# EAGLE design bunai3 (EAGLE 7.2.0)
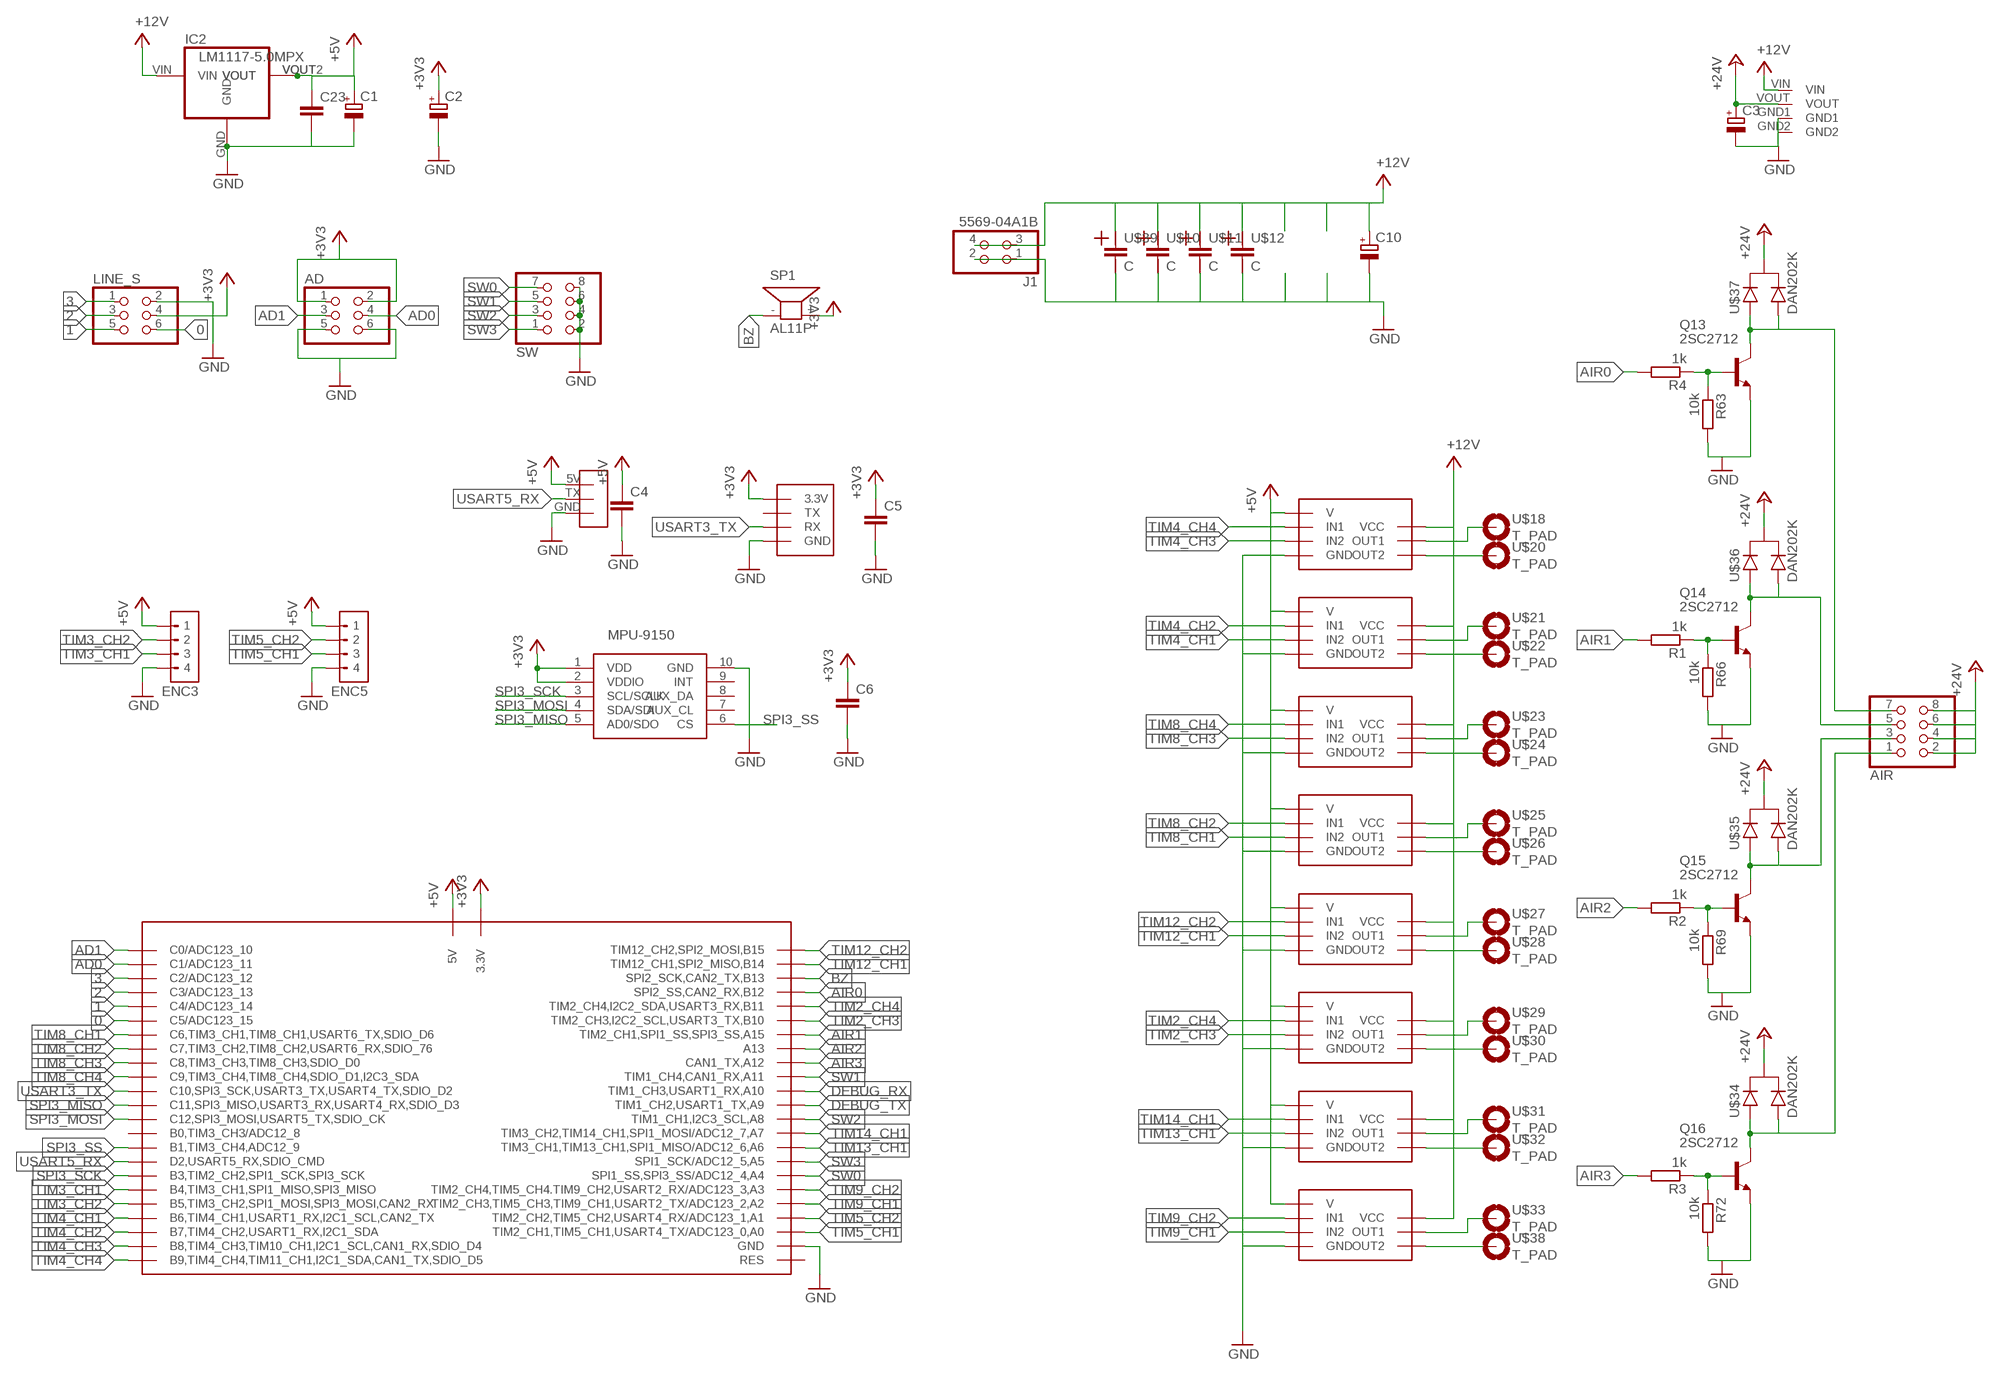
[diagram p0: schematic, sheet 1]

## Parts
AD  PINHD-2X3/90  [2X03/90]
AIR  PINHD-2X4/90  [2X04/90]
C1  CPOL-EUE2.5-6  [E2,5-6]
C2  CPOL-EUE2.5-6  [E2,5-6]
C3  CPOL-EUE2.5-6  [E2,5-6]
C4  C-EU025-024X044  [C025-024X044]
C5  C-EU025-024X044  [C025-024X044]
C6  C-EU025-024X044  [C025-024X044]
C10  CPOL-EUE2.5-6  [E2,5-6]
C23  C-EUC0603K  [C0603K]
ENC3  CN4-JST-XH-TOP  [JST-B4B-XH-A]
ENC5  CN4-JST-XH-TOP  [JST-B4B-XH-A]
IC2  LM1117-5.0MPX  LM1117-5.0IMP  [SOT223]
J1  5569-04A1B  [5569-04A1_2]
LINE_S  PINHD-2X3/90  [2X03/90]
MPU-9250  MPU-9250  [MPU-9250]
Q13  2SC2712  [SC-59(TYPE1)]
Q14  2SC2712  [SC-59(TYPE1)]
Q15  2SC2712  [SC-59(TYPE1)]
Q16  2SC2712  [SC-59(TYPE1)]
R1  1k  R-EU_0207/7  [0207/7]
R2  1k  R-EU_0207/7  [0207/7]
R3  1k  R-EU_0207/7  [0207/7]
R4  1k  R-EU_0207/7  [0207/7]
R63  10k  R-EU_R0603  [R0603]
R66  10k  R-EU_R0603  [R0603]
R69  10k  R-EU_R0603  [R0603]
R72  10k  R-EU_R0603  [R0603]
SP1  AL11P  [AL11P]
SW  PINHD-2X4/90  [2X04/90]
U$1  F4_T  [F4_T]
U$2  BTM7752_T  [BTM7752_T]
U$3  BTM7752_T  [BTM7752_T]
U$4  BTM7752_T  [BTM7752_T]
U$5  BTM7752_T  [BTM7752_T]
U$6  BTM7752_T  [BTM7752_T]
U$7  BTM7752_T  [BTM7752_T]
U$8  BTM7752_T  [BTM7752_T]
U$9  BTM7752_T  [BTM7752_T]
U$10  C  [C]
U$11  C  [C]
U$12  C  [C]
U$16  LT3580  [LT3580]
U$17  SBDBT_5V  [SBDBT_5V]
U$18  T_PAD  [T_PAD]
U$19  XBEE_T  [XBEE_T]
U$20  T_PAD  [T_PAD]
U$21  T_PAD  [T_PAD]
U$22  T_PAD  [T_PAD]
U$23  T_PAD  [T_PAD]
U$24  T_PAD  [T_PAD]
U$25  T_PAD  [T_PAD]
U$26  T_PAD  [T_PAD]
U$27  T_PAD  [T_PAD]
U$28  T_PAD  [T_PAD]
U$29  T_PAD  [T_PAD]
U$30  T_PAD  [T_PAD]
U$31  T_PAD  [T_PAD]
U$32  T_PAD  [T_PAD]
U$33  T_PAD  [T_PAD]
U$34  DAN202K  [SC-59]
U$35  DAN202K  [SC-59]
U$36  DAN202K  [SC-59]
U$37  DAN202K  [SC-59]
U$38  T_PAD  [T_PAD]
U$39  C  [C]

## Nets
0: LINE_S.6 U$1.C5(C5/ADC123_15)
1: LINE_S.5 U$1.C4(C4/ADC123_14)
2: LINE_S.3 U$1.C3(C3/ADC123_13)
3: LINE_S.1 U$1.C2(C2/ADC123_12)
+3V3: AD.1 AD.2 C2.+ C5.1 C6.1 LINE_S.4 MPU-9250.1(VDD) MPU-9250.2(VDDIO) SP1.+ U$1.3.3V U$1.3.3V1(3.3V) U$19.3.3V
+5V [VCC]: C1.+ C4.1 C23.1 ENC3.1 ENC5.1 IC2.VOUT IC2.VOUT2(VOUT) U$1.5V U$1.5V1(5V) U$2.V U$3.V U$4.V U$5.V U$6.V U$7.V U$8.V U$9.V U$17.5V
+24V: AIR.2 AIR.4 AIR.6 AIR.8 C3.+ U$16.VOUT U$34.K U$35.K U$36.K U$37.K
AD0: AD.4 U$1.C1(C1/ADC123_11)
AD1: AD.3 U$1.C0(C0/ADC123_10)
AIR0: R4.2 U$1.B12(SPI2_SS,CAN2_RX,B12)
AIR1: R1.2 U$1.A15(TIM2_CH1,SPI1_SS,SPI3_SS,A15)
AIR2: R2.2 U$1.A13
AIR3: R3.2 U$1.A12(CAN1_TX,A12)
BZ: SP1.- U$1.B13(SPI2_SCK,CAN2_TX,B13)
DEBUG_RX: U$1.A10(TIM1_CH3,USART1_RX,A10)
DEBUG_TX: U$1.A9(TIM1_CH2,USART1_TX,A9)
GND: AD.5 AD.6 C1.- C2.- C3.- C4.2 C5.2 C6.2 C10.- C23.2 ENC3.4 ENC5.4 IC2.GND J1.1 J1.2 LINE_S.2 MPU-9250.10(GND) Q13.E Q14.E Q15.E Q16.E R63.2 R66.2 R69.2 R72.2 SW.2 SW.4 SW.6 SW.8 U$1.GND1(GND) U$1.GND2(GND) U$1.GND3(GND) U$2.GND1(GND) U$2.GND2(GND) U$2.GND3(GND) U$3.GND1(GND) U$3.GND2(GND) U$3.GND3(GND) U$4.GND1(GND) U$4.GND2(GND) U$4.GND3(GND) U$5.GND1(GND) U$5.GND2(GND) U$5.GND3(GND) U$6.GND1(GND) U$6.GND2(GND) U$6.GND3(GND) U$7.GND1(GND) U$7.GND2(GND) U$7.GND3(GND) U$8.GND1(GND) U$8.GND2(GND) U$8.GND3(GND) U$9.GND1(GND) U$9.GND2(GND) U$9.GND3(GND) U$16.GND1 U$16.GND2 U$17.GND U$19.GND
N$5: U$9.OUT11(OUT1) U$9.OUT12(OUT1) U$9.OUT13(OUT1) U$9.OUT14(OUT1) U$18.P$1(MOUNT)
N$6: U$9.OUT21(OUT2) U$9.OUT22(OUT2) U$9.OUT23(OUT2) U$9.OUT24(OUT2) U$20.P$1(MOUNT)
N$7: U$8.OUT11(OUT1) U$8.OUT12(OUT1) U$8.OUT13(OUT1) U$8.OUT14(OUT1) U$21.P$1(MOUNT)
N$8: U$8.OUT21(OUT2) U$8.OUT22(OUT2) U$8.OUT23(OUT2) U$8.OUT24(OUT2) U$22.P$1(MOUNT)
N$9: U$7.OUT11(OUT1) U$7.OUT12(OUT1) U$7.OUT13(OUT1) U$7.OUT14(OUT1) U$23.P$1(MOUNT)
N$10: U$7.OUT21(OUT2) U$7.OUT22(OUT2) U$7.OUT23(OUT2) U$7.OUT24(OUT2) U$24.P$1(MOUNT)
N$11: U$6.OUT11(OUT1) U$6.OUT12(OUT1) U$6.OUT13(OUT1) U$6.OUT14(OUT1) U$25.P$1(MOUNT)
N$12: U$6.OUT21(OUT2) U$6.OUT22(OUT2) U$6.OUT23(OUT2) U$6.OUT24(OUT2) U$26.P$1(MOUNT)
N$13: U$5.OUT11(OUT1) U$5.OUT12(OUT1) U$5.OUT13(OUT1) U$5.OUT14(OUT1) U$27.P$1(MOUNT)
N$14: U$5.OUT21(OUT2) U$5.OUT22(OUT2) U$5.OUT23(OUT2) U$5.OUT24(OUT2) U$28.P$1(MOUNT)
N$15: U$4.OUT11(OUT1) U$4.OUT12(OUT1) U$4.OUT13(OUT1) U$4.OUT14(OUT1) U$29.P$1(MOUNT)
N$16: U$4.OUT21(OUT2) U$4.OUT22(OUT2) U$4.OUT23(OUT2) U$4.OUT24(OUT2) U$30.P$1(MOUNT)
N$17: U$3.OUT11(OUT1) U$3.OUT12(OUT1) U$3.OUT13(OUT1) U$3.OUT14(OUT1) U$31.P$1(MOUNT)
N$18: U$3.OUT21(OUT2) U$3.OUT22(OUT2) U$3.OUT23(OUT2) U$3.OUT24(OUT2) U$32.P$1(MOUNT)
N$19: U$2.OUT11(OUT1) U$2.OUT12(OUT1) U$2.OUT13(OUT1) U$2.OUT14(OUT1) U$33.P$1(MOUNT)
N$20: U$2.OUT21(OUT2) U$2.OUT22(OUT2) U$2.OUT23(OUT2) U$2.OUT24(OUT2) U$38.P$1(MOUNT)
N$95: Q13.B R4.1 R63.1
N$96: AIR.7 Q13.C U$37.A@1(A1) U$37.A@2(A2)
N$101: Q14.B R1.1 R66.1
N$102: AIR.5 Q14.C U$36.A@1(A1) U$36.A@2(A2)
N$105: Q15.B R2.1 R69.1
N$106: AIR.3 Q15.C U$35.A@1(A1) U$35.A@2(A2)
N$108: AIR.1 Q16.C U$34.A@1(A1) U$34.A@2(A2)
N$109: Q16.B R3.1 R72.1
SPI3_MISO: MPU-9250.5(AD0/SDO) U$1.C11(C11,SPI3_MISO,USART3_RX,USART4_RX,SDIO_D3)
SPI3_MOSI: MPU-9250.4(SDA/SDI) U$1.C12(C12,SPI3_MOSI,USART5_TX,SDIO_CK)
SPI3_SCK: MPU-9250.3(SCL/SCLK) U$1.B3(B3,TIM2_CH2,SPI1_SCK,SPI3_SCK)
SPI3_SS: MPU-9250.6(CS) U$1.B1(B1,TIM3_CH4,ADC12_9)
SW0: SW.7 U$1.A4(SPI1_SS,SPI3_SS/ADC12_4,A4)
SW1: SW.5 U$1.A11(TIM1_CH4,CAN1_RX,A11)
SW2: SW.3 U$1.A8(TIM1_CH1,I2C3_SCL,A8)
SW3: SW.1 U$1.A5(SPI1_SCK/ADC12_5,A5)
TIM2_CH3: U$1.B10(TIM2_CH3,I2C2_SCL,USART3_TX,B10) U$4.IN2
TIM2_CH4: U$1.B11(TIM2_CH4,I2C2_SDA,USART3_RX,B11) U$4.IN1
TIM3_CH1: ENC3.3 U$1.B4(B4,TIM3_CH1,SPI1_MISO,SPI3_MISO)
TIM3_CH2: ENC3.2 U$1.B5(B5,TIM3_CH2,SPI1_MOSI,SPI3_MOSI,CAN2_RX)
TIM4_CH1: U$1.B6(B6,TIM4_CH1,USART1_RX,I2C1_SCL,CAN2_TX) U$8.IN2
TIM4_CH2: U$1.B7(B7,TIM4_CH2,USART1_RX,I2C1_SDA) U$8.IN1
TIM4_CH3: U$1.B8(B8,TIM4_CH3,TIM10_CH1,I2C1_SCL,CAN1_RX,SDIO_D4) U$9.IN2
TIM4_CH4: U$1.B9(B9,TIM4_CH4,TIM11_CH1,I2C1_SDA,CAN1_TX,SDIO_D5) U$9.IN1
TIM5_CH1: ENC5.3 U$1.A0(TIM2_CH1,TIM5_CH1,USART4_TX/ADC123_0,A0)
TIM5_CH2: ENC5.2 U$1.A1(TIM2_CH2,TIM5_CH2,USART4_RX/ADC123_1,A1)
TIM8_CH1: U$1.C6(C6,TIM3_CH1,TIM8_CH1,USART6_TX,SDIO_D6) U$6.IN2
TIM8_CH2: U$1.C7(C7,TIM3_CH2,TIM8_CH2,USART6_RX,SDIO_76) U$6.IN1
TIM8_CH3: U$1.C8(C8,TIM3_CH3,TIM8_CH3,SDIO_D0) U$7.IN2
TIM8_CH4: U$1.C9(C9,TIM3_CH4,TIM8_CH4,SDIO_D1,I2C3_SDA) U$7.IN1
TIM9_CH1: U$1.A2(TIM2_CH3,TIM5_CH3,TIM9_CH1,USART2_TX/ADC123_2,A2) U$2.IN2
TIM9_CH2: U$1.A3(TIM2_CH4,TIM5_CH4.TIM9_CH2,USART2_RX/ADC123_3,A3) U$2.IN1
TIM12_CH1: U$1.B14(TIM12_CH1,SPI2_MISO,B14) U$5.IN2
TIM12_CH2: U$1.B15(TIM12_CH2,SPI2_MOSI,B15) U$5.IN1
TIM13_CH1: U$1.A6(TIM3_CH1,TIM13_CH1,SPI1_MISO/ADC12_6,A6) U$3.IN2
TIM14_CH1: U$1.A7(TIM3_CH2,TIM14_CH1,SPI1_MOSI/ADC12_7,A7) U$3.IN1
USART3_TX: U$1.C10(C10,SPI3_SCK,USART3_TX,USART4_TX,SDIO_D2) U$19.RX
USART5_RX: U$1.D2(D2,USART5_RX,SDIO_CMD) U$17.TX(TX_5V)
V+: C10.+ IC2.VIN J1.3 J1.4 U$2.VCC1(VCC) U$2.VCC2(VCC) U$2.VCC3(VCC) U$2.VCC4(VCC) U$3.VCC1(VCC) U$3.VCC2(VCC) U$3.VCC3(VCC) U$3.VCC4(VCC) U$4.VCC1(VCC) U$4.VCC2(VCC) U$4.VCC3(VCC) U$4.VCC4(VCC) U$5.VCC1(VCC) U$5.VCC2(VCC) U$5.VCC3(VCC) U$5.VCC4(VCC) U$6.VCC1(VCC) U$6.VCC2(VCC) U$6.VCC3(VCC) U$6.VCC4(VCC) U$7.VCC1(VCC) U$7.VCC2(VCC) U$7.VCC3(VCC) U$7.VCC4(VCC) U$8.VCC1(VCC) U$8.VCC2(VCC) U$8.VCC3(VCC) U$8.VCC4(VCC) U$9.VCC1(VCC) U$9.VCC2(VCC) U$9.VCC3(VCC) U$9.VCC4(VCC) U$16.VIN ; supply symbol labelled +12V
Unconnected: MPU-9250.7(AUX_CL) MPU-9250.8(AUX_DA) MPU-9250.9(INT) U$1.B0(B0,TIM3_CH3/ADC12_8) U$1.RES U$19.TX

## Library data of the parts
AD LINE_S = pinhead:PINHD-2X3: PIN HEADER
AIR SW = pinhead:PINHD-2X4: PIN HEADER
C1-C3 C10 = rcl:CPOL-EU: POLARIZED CAPACITOR, European symbol
C4-C6 = rcl:C-EU: CAPACITOR, European symbol
C23 = resistor:C-EU: CAPACITOR, European symbol
ENC3 ENC5 = con-jst_xh:CN4: Connector 4 circuits
IC2 = Regulator:LM1117: 800mA and 1A Low Dropout (LDO) Positive Regulator 1.8V, 2.5V, 2.85V, 3.3V, 5V, and Adj
J1 = Molex:5569-04A1
MPU-9250 = MPU-9250:MPU-9250
Q13-Q16 = Transistor:2SC2712
R1-R4 R63 R66 R69 R72 = rcl:R-EU_: RESISTOR, European symbol
SP1 = buzzer:AL11P: SPEAKER Source: Buerklin; OC_FARNELL: unknown; OC_NEWARK: unknown
U$1 = f4_t:F4_T
U$2-U$9 = BTM7752_t:BTM7752_T
U$10-U$12 U$39 = T_C:C
U$16 = lt3580:LT3580
U$17 = SBDBT_5V:SBDBT_5V
U$18 U$20-U$33 U$38 = T_pad:T_PAD
U$19 = Xbee_t:XBEE_T
U$34-U$37 = DAN202K:DAN202K

## Board
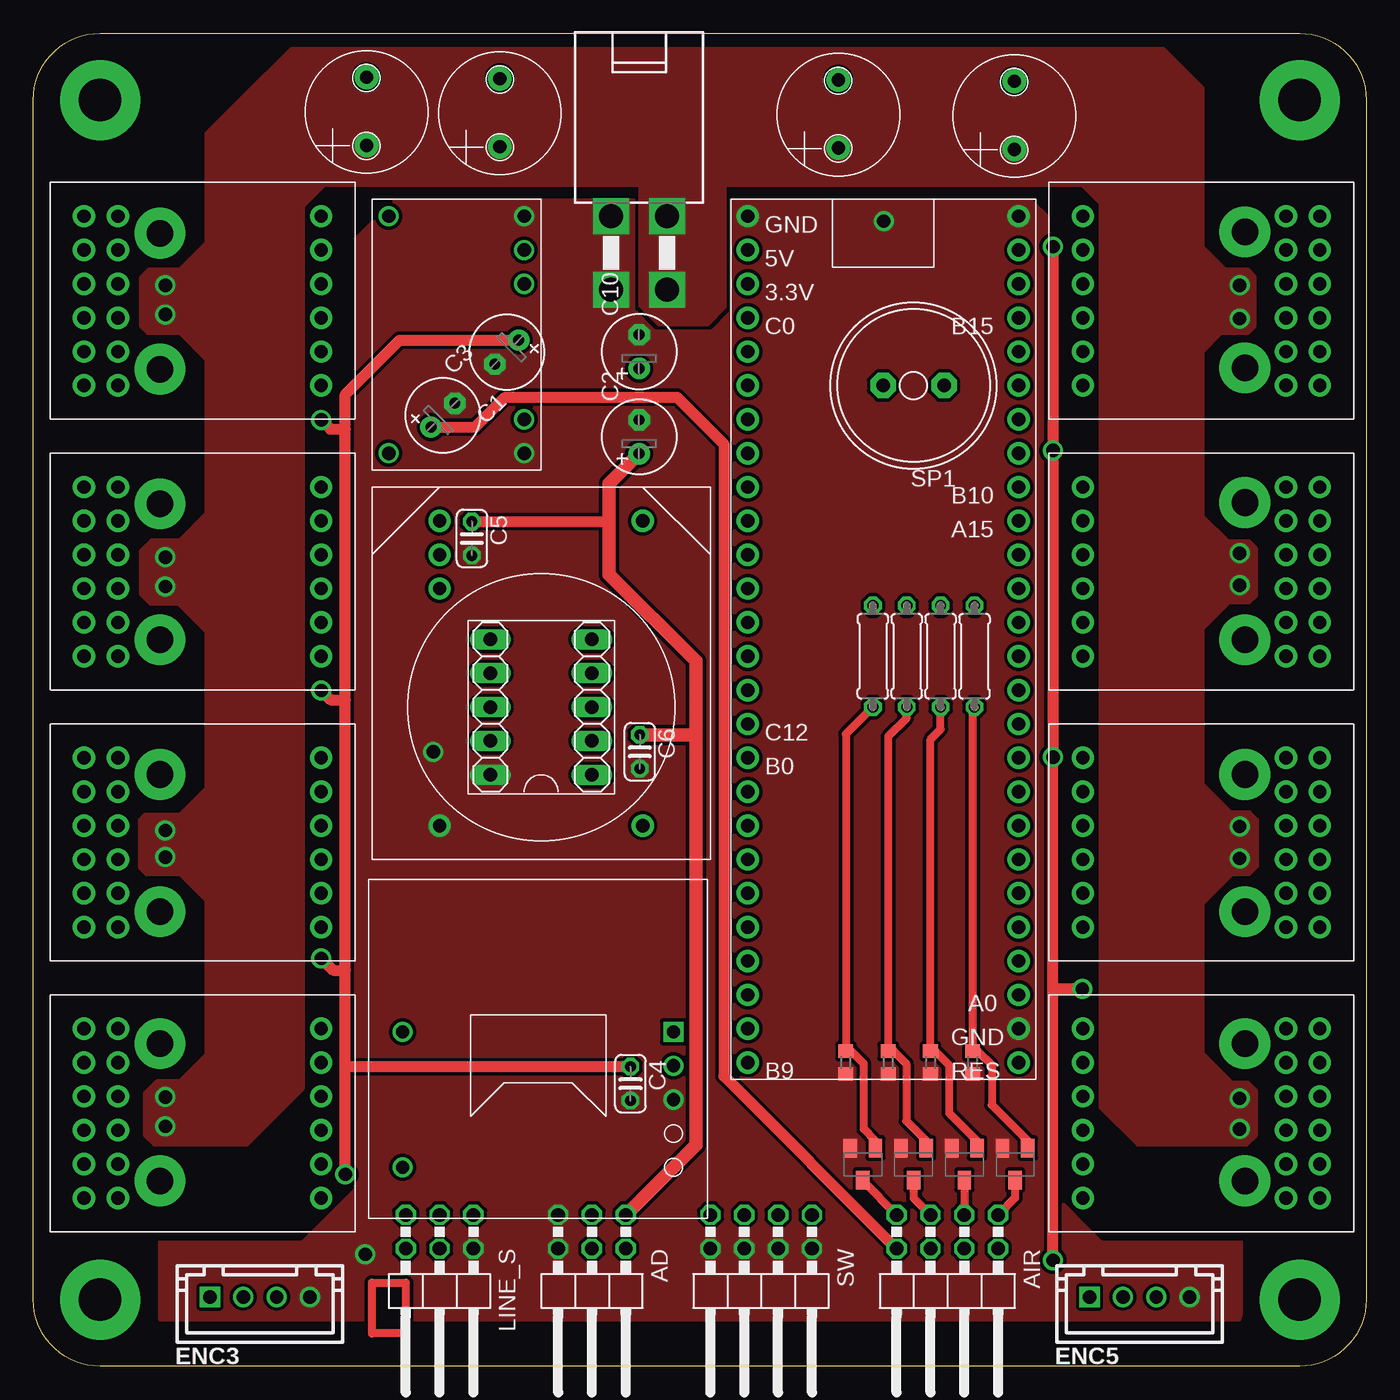
[diagram p1: board, top side]
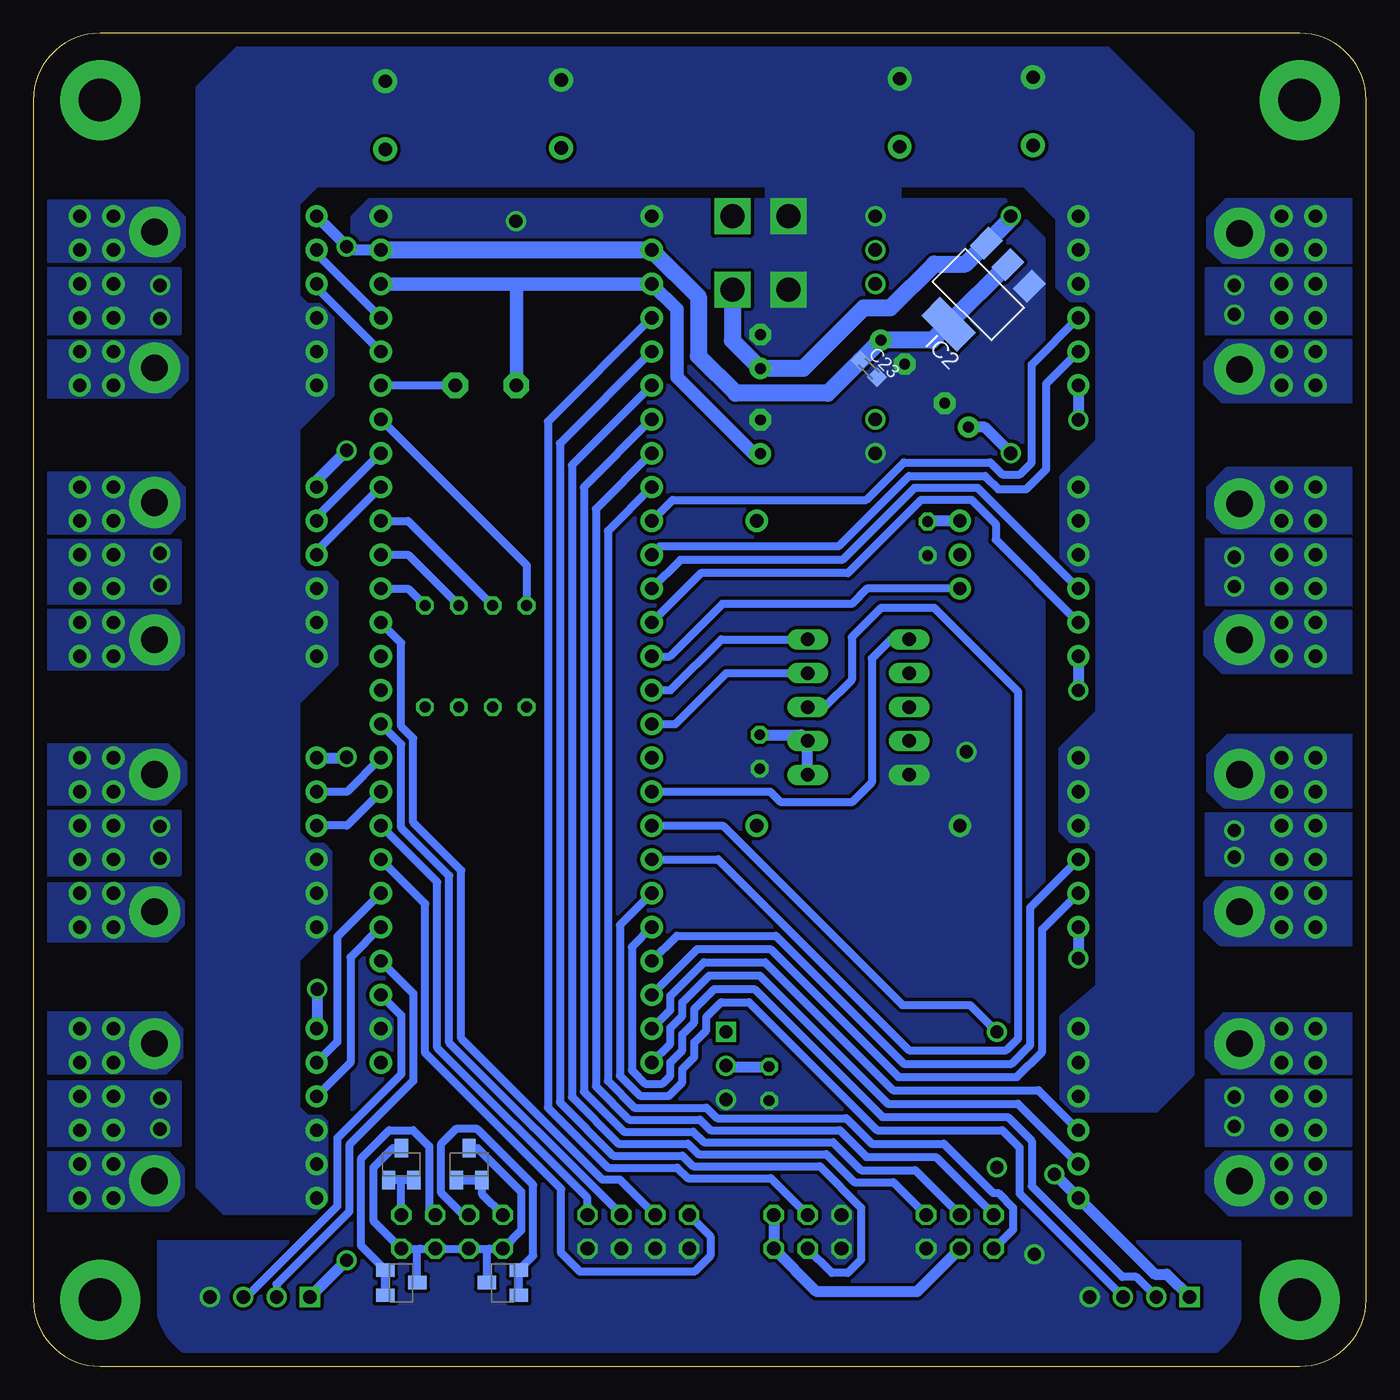
[diagram p2: board, bottom side, seen from below]

Size 100 x 100 mm. Coordinates in mm from the lower left corner, seen from the top.
Outline: 0,95 arc-90 5,100 95,100 arc-90 100,95 100,5 arc-90 95,0 5,0 arc-90 0,5 0,95
Copper layers (1*16): Top 0.035mm / dielectric 1.5mm / Bottom 0.035mm
Design rules "default *": minimum track width 10mil, minimum drill 24mil, track to track 10mil, track to pad 10mil, pad to pad 10mil, via to via 10mil, smd to smd 10mil, copper to edge 40mil, drill to drill 8mil, minimum pad ring 10mil, minimum via ring 8mil, stop-mask expansion 4mil, vias tented up to drill 0mil, thermal gap 10mil
tRestrict: 12 lines
bRestrict: 12 lines

### Footprints (pad centres in the part's own frame; a part is rotated, then mirrored left to right if it is on the bottom)
2X03/90 = drill 1.016 octagon: 1 -2.54,-6.35; 2 -2.54,-3.81; 3 0,-6.35; 4 0,-3.81; 5 2.54,-6.35; 6 2.54,-3.81
2X04/90 = drill 1.016 octagon: 1 -3.81,-6.35; 2 -3.81,-3.81; 3 -1.27,-6.35; 4 -1.27,-3.81; 5 1.27,-6.35; 6 1.27,-3.81; 7 3.81,-6.35; 8 3.81,-3.81
E2,5-6 = drill 0.813 pad 1.6: + -1.27,0 | drill 0.813 pad 1.6 octagon: - 1.27,0
C025-024X044 = drill 0.813 octagon: 1 -1.27,0; 2 1.27,0
C0603K = smd 1.05 x 1.08: 1 -0.875,0; 2 0.875,0
JST-B4B-XH-A = drill 1 square: 1 -3.75,0 | drill 1: 2 -1.25,0; 3 1.25,0; 4 3.75,0
SOT223 = smd 1.499 x 2.007: GND -2.261,-3.15; VIN 2.311,-3.15; VOUT 0.025,-3.15 | smd 3.81 x 2.007: VOUT2 0,3.15
5569-04A1_2 = drill 1.8 square: 1 2.1,0; 2 2.1,5.5; 3 -2.1,0; 4 -2.1,5.5
MPU-9250 = drill 1.016 long: 1 -3.81,5.08; 2 -3.81,2.54; 3 -3.81,0; 4 -3.81,-2.54; 5 -3.81,-5.08; 6 3.81,-5.08; 7 3.81,-2.54; 8 3.81,0; 9 3.81,2.54; 10 3.81,5.08
SC-59(TYPE1) = smd 1 x 1.4: B -0.95,-1.2; C 0,1.2; E 0.95,-1.2
0207/7 = drill 0.813 octagon: 1 -3.81,0; 2 3.81,0
R0603 = smd 1 x 1.1: 1 -0.85,0; 2 0.85,0
AL11P = drill 1.016 pad 1.905 octagon: + 2.286,0; - -2.286,0
F4_T = drill 1 pad 1.676: 3.3V -10.16,36.83; 3.3V1 10.16,36.83; 5V -10.16,39.37; 5V1 10.16,39.37; A0 10.16,-16.51; A1 10.16,-13.97; A2 10.16,-11.43; A3 10.16,-8.89; A4 10.16,-6.35; A5 10.16,-3.81; A6 10.16,-1.27; A7 10.16,1.27; A8 10.16,3.81; A9 10.16,6.35; A10 10.16,8.89; A11 10.16,11.43; A12 10.16,13.97; A13 10.16,16.51; A15 10.16,19.05; B0 -10.16,1.27; B1 -10.16,-1.27; B3 -10.16,-6.35; B4 -10.16,-8.89; B5 -10.16,-11.43; B6 -10.16,-13.97; B7 -10.16,-16.51; B8 -10.16,-19.05; B9 -10.16,-21.59; B10 10.16,21.59; B11 10.16,24.13; B12 10.16,26.67; B13 10.16,29.21; B14 10.16,31.75; B15 10.16,34.29; C0 -10.16,34.29; C1 -10.16,31.75; C2 -10.16,29.21; C3 -10.16,26.67; C4 -10.16,24.13; C5 -10.16,21.59; C6 -10.16,19.05; C7 -10.16,16.51; C8 -10.16,13.97; C9 -10.16,11.43; C10 -10.16,8.89; C11 -10.16,6.35; C12 -10.16,3.81; D2 -10.16,-3.81; GND1 -10.16,41.91; GND2 10.16,41.91; GND3 10.16,-19.05; RES 10.16,-21.59
BTM7752_T = drill 1 pad 1.676: GND1 -7.62,-1.27; GND2 -7.62,-3.81; GND3 -7.62,-6.35; IN1 -7.62,3.81; IN2 -7.62,1.27; OUT11 7.62,-3.81; OUT12 10.16,-3.81; OUT13 7.62,-6.35; OUT14 10.16,-6.35; OUT21 7.62,6.35; OUT22 10.16,6.35; OUT23 7.62,3.81; OUT24 10.16,3.81; V -7.62,6.35; VCC1 7.62,1.27; VCC2 10.16,1.27; VCC3 7.62,-1.27; VCC4 10.16,-1.27
LT3580 = drill 1: GND1 1.27,11.43; GND2 19.05,11.43; P$2 3.81,11.43; P$4 6.35,11.43; P$5 16.51,11.43; VIN 1.27,1.27; VOUT 19.05,1.27
SBDBT_5V = drill 1 square: 1 10.16,1.27 | drill 1: 5V 10.16,-1.27; GND 10.16,-3.81; RX -10.16,-8.89; TX -10.16,1.27
T_PAD = drill 2 pad 3.81: P$1 0,0
XBEE_T = drill 1 pad 1.676: 3.3V -7.62,22.86; GND -7.62,0; P$2 7.62,0; P$4 7.62,22.86; RX -7.62,17.78; TX -7.62,20.32
SC-59 = smd 1 x 1.4: A@1 -0.95,-1.2; A@2 0.95,-1.2; K 0,1.2

### Placement (x,y rotation side)
AD  41.91,5 180 top
AIR  68.58,5 180 top
C1  35.52,76.08 225 top
C2  45.45,69.73 90 top
C3  30.73,71.35 45 top
C4  44.8,21.2 270 top
C5  32.9,62.1 270 top
C6  45.5,46.1 270 top
C10  45.45,76.12 90 top
C23  37.32,74.83 315 bottom
ENC3  17,5.19 0 top
ENC5  83,5.19 0 top
IC2  29.1,80.4 135 bottom
J1  45.45,86.28 180 top
LINE_S  30.48,5 180 top
MPU-9250  38.1,49.45 180 top
Q13  62.23,15.16 180 top
Q14  66.04,15.16 180 top
Q15  69.85,15.16 180 top
Q16  73.66,15.16 180 top
R1  65.53,53.26 90 top
R2  68.07,53.26 90 top
R3  70.61,53.26 90 top
R4  62.99,53.26 90 top
R63  60.96,22.78 270 top
R66  64.14,22.78 270 top
R69  67.31,22.78 270 top
R72  70.48,22.78 270 top
SP1  66.04,73.58 180 top
SW  54.61,5 180 top
U$1  63.77,44.37 0 top
U$2  86.36,18.97 0 top
U$3  86.36,39.29 0 top
U$4  86.36,59.61 0 top
U$5  86.36,79.93 0 top
U$6  13.97,79.93 180 top
U$7  13.97,59.61 180 top
U$8  13.97,39.29 180 top
U$9  13.97,18.97 180 top
U$10  25,94.1 90 top
U$11  73.6,93.8 90 top
U$12  60.4,93.9 90 top
U$16  25.4,87.55 270 top
U$17  37.87,23.81 0 top
U$18  9.5,24.2 0 top
U$19  38.1,40.56 0 top
U$20  9.5,13.9 0 top
U$21  9.5,44.4 0 top
U$22  9.5,34.1 0 top
U$23  9.5,64.7 0 top
U$24  9.5,54.5 0 top
U$25  9.5,85 0 top
U$26  9.5,74.8 0 top
U$27  90.9,74.9 0 top
U$28  90.9,85.1 0 top
U$29  90.9,54.5 0 top
U$30  90.9,64.8 0 top
U$31  90.9,34.1 0 top
U$32  90.9,44.4 0 top
U$33  90.9,13.9 0 top
U$34  72.39,15.16 0 bottom
U$35  72.39,6.27 270 bottom
U$36  64.77,6.27 90 bottom
U$37  67.31,15.16 0 bottom
U$38  90.9,24.2 0 top
U$39  35,94 90 top

### Tracks (layer width: path | path; a pad name or v marks a point on that pad's centre or on a via)
0
  Bottom 0.61: LINE_S.6 26.5,10.25 26.5,11.9 27.6,13 28,13 31.7,16.7 37.1,16.7 39,18.6 48.7,18.6 49.5,19.4 54.9,19.4 56.9,21.4 56.9,62.67 U$1.C5
1
  Bottom 0.61: LINE_S.5 32.29,15.7 37.5,15.7 39.5,17.7 49.2,17.7 50,18.5 55.3,18.5 57.8,21 57.8,64.31 U$1.C4
2
  Bottom 0.61: LINE_S.3 33.83,14.7 37.9,14.7 40,16.8 49.7,16.8 50.5,17.6 55.7,17.6 58.7,20.6 58.7,65.95 U$1.C3
3
  Bottom 0.61: LINE_S.1 35.47,13.8 38.4,13.8 40.5,15.9 50.1,15.9 50.9,16.7 56.1,16.7 59.6,20.2 59.6,67.59 U$1.C2
+3V3
  Top 0.813: C5.1 43.17,63.37 43.2,63.4
  Top 1.016: 49.7,47.3 49.7,52.9 43.2,59.4 43.2,63.4 43.2,66.21 C2.+ | 49.7,47.3 49.7,16.6 AD.1 | C6.1 49.63,47.37 49.7,47.3
  Bottom 0.813: LINE_S.4 33.69,5.6 41.24,5.6 AD.2 AD.1 | U$19.3.3V 32.85,63.42 C5.1 | MPU-9250.1 MPU-9250.2 42.37,47.37 C6.1
  Bottom 1.016: U$1.3.3V1 63.8,81.2 | 63.8,81.2 U$1.3.3V 51.7,79.29 51.7,74.2 45.96,68.46 C2.+ | SP1.+ 63.75,81.15 63.8,81.2
+5V  (via drill 1)
  Top 0.813: v76.5,84 v76.5,68.7 v76.5,45.7 76.5,28.3 | v76.5,7.94 76.5,28.3 | v78.7,28.3 76.5,28.3 | v23.4,14.4 23.4,22.6 | 23.4,22.6 23.4,29.7 | 23.4,29.7 23.4,50 | 23.4,50 23.4,70.3 | 23.4,70.3 23.4,72.9 27.48,76.98 C1.+ | v21.6,71 22.3,70.3 23.4,70.3 | v21.6,50.7 22.3,50 23.4,50 | v21.6,30.6 22.5,29.7 23.4,29.7 | C4.1 23.53,22.47 23.4,22.6
  Bottom 0.813: U$5.V 76.5,84.04 v76.5,84 76.24,83.74 U$1.5V1 | v78.7,28.3 78.7,25.36 U$2.V | U$3.V 76.56,45.64 v76.5,45.7 | U$4.V 78.74,66.46 v76.5,68.7 | ENC3.1 14.96,6.9 15.87,6.9 U$9.V 23.37,14.4 v23.4,14.4 | v76.5,7.94 ENC5.1 | U$6.V v21.59,71.01 v21.6,71 | U$7.V v21.6,50.7 | U$8.V v21.59,30.61 v21.6,30.6 | U$17.5V 47.96,22.47 C4.1
  Bottom 1.27: U$1.5V1 U$1.5V 50.1,80.23 50.1,75.8 47.3,73 40.4,73 C23.1 36.42,76.97 C1.+ 32.56,76.98 31.33,78.21 | IC2.VOUT 31.33,78.21 | 31.33,78.21 IC2.VOUT2
+24V
  Top 0.813: C3.+ 33.15,70.45 35.4,72.7 48.3,72.7 51.8,69.2 51.8,21.78 AIR.8
  Bottom 0.61: U$36.K 65.97,8.64 65.8,8.81 | 71,8.81 AIR.2 74.5,10.92 74.5,14.9 73.04,16.36 U$34.K | 71,8.81 AIR.4 AIR.6 65.8,8.81 | 65.8,8.81 AIR.8 63.4,10.18 63.4,13.1 66.66,16.36 U$37.K | U$35.K 71.19,8.62 71,8.81
  Bottom 0.813: U$16.VOUT 28.62,70.45 C3.+
AD0
  Bottom 0.61: AD.4 40.1,7 38.9,7 37.9,8 37.9,11.9 41,15 50.5,15 51.3,15.8 56.5,15.8 60.5,19.8 60.5,69.23 U$1.C1
AD1
  Bottom 0.61: AD.3 44.66,14.1 50.9,14.1 51.7,14.9 56.9,14.9 61.4,19.4 61.4,70.87 U$1.C0
AIR0
  Bottom 0.61: U$1.B12 62.99,60.1 R4.2
AIR1
  Bottom 0.61: U$1.A15 71.88,63.42 R1.2
AIR2
  Bottom 0.61: U$1.A13 71.88,60.88 R2.2
AIR3
  Bottom 0.61: U$1.A12 71.88,58.34 R3.2
BZ
  Bottom 0.61: SP1.- U$1.B13
GND  (via drill 1, 1 pad 1.78)
  other vias: 30,46.1 24.9,8.4 63.8,85.9 25,96.7 35,96.6 60.4,96.5 73.6,96.4
  pour Bottom (rank 6, no thermals): 45.5,100.9 45.5,88.6 25.7,88.6 23.2,86.1 23.2,81 22.2,80 21,80 20.2,79.2 20.2,69.4 22.9,66.7 22.9,60.7 21.9,59.7 20.9,59.7 20.2,59 20.2,49.1 23,46.3 23,40.2 22.2,39.4 20.9,39.4 20.2,38.7 20.2,28.5 22.9,26.2 22.9,20.1 22,19.2 15.7,19.2 13,21.9 13,92.5 21.4,100.9
  pour Bottom (rank 6, no thermals): 40.5,103.8 79.8,103.8 87.7,95.9 87.7,13.5 85.7,11.5 78.9,11.5 78,12.4 78,18.3 78.4,18.7 79.4,18.7 80.1,19.4 80.1,30.5 77.7,32.9 77.7,38.6 78.2,39.1 79.2,39.1 80.1,40 80.1,49.8 77.2,52.7 77.2,58.8 77.9,59.5 79.5,59.5 80.1,60.1 80.1,70.3 77.5,72.9 77.5,78.6 78.5,79.6 79.4,79.6 80.1,80.3 80.1,87.2 78.7,88.6 40.5,88.6
  pour Bottom (rank 6, no thermals): 27.1,87.5 74.8,87.5 76.1,86.2 76.1,13.3 80.1,9.3 90.6,9.3 90.6,-7.1 9.5,-7.1 9.5,9.3 20.2,9.3 24.2,13.3 24.2,84.6
  pour Top (rank 6, no thermals): 27.1,87.5 74.8,87.5 76.1,86.2 76.1,13.3 80.1,9.3 90.6,9.3 90.6,3.5 9.5,3.5 9.5,9.3 20.2,9.3 24.2,13.3 24.2,84.6
  pour Bottom (rank 6, no thermals): 45,90 45,87 35,87 35,90
N$1  (via drill 3.2 pad 6)
  other vias: 5,5
N$2  (via drill 3.2 pad 6)
  other vias: 95,5
N$3  (via drill 3.2 pad 6)
  other vias: 95,95
N$4  (via drill 3.2 pad 6)
  other vias: 5,95
N$5
  pour Bottom (no thermals): -0.7,26.4 10.7,26.4 12,25.1 12,23.2 10.8,22 -0.7,22
N$6
  pour Bottom (no thermals): -1.1,16 10.6,16 12,14.6 12,13.1 10.7,11.8 10.6,11.7 10.3,11.4 -1.1,11.4
N$7
  pour Bottom (no thermals): -1.3,47.3 10.4,47.3 11.9,45.8 11.9,43.2 10.7,42 -1.3,42
N$8
  pour Bottom (no thermals): -1.4,36.3 10.6,36.3 12.1,34.8 12.1,32.8 11,31.7 -1.4,31.7
N$9
  pour Bottom (no thermals): -1.2,67.3 10.5,67.3 11.9,65.9 11.9,63.7 10.8,62.6 -1.2,62.6
N$10
  pour Bottom (no thermals): -1.1,56.6 10.6,56.6 12.1,55.1 12.1,53.4 10.8,52.1 -1.1,52.1
N$11
  pour Bottom (rank 3, no thermals): -1.7,87.5 10.5,87.5 11.9,86.1 11.9,84 10.7,82.8 -1.7,82.8
N$12
  pour Bottom (no thermals): 0.3,76.9 10.5,76.9 12.1,75.3 12.1,73.7 10.8,72.4 0.3,72.4
N$13
  pour Bottom (no thermals): 102.5,76.9 89.7,76.9 88.5,75.7 88.5,74 89.8,72.7 102.5,72.7
N$14
  pour Bottom (no thermals): 101.9,87.4 89.9,87.4 88.7,86.2 88.7,84 89.7,83 89.8,82.9 101.9,82.9
N$15
  pour Bottom (no thermals): 101.1,56.7 90.1,56.7 88.8,55.4 88.8,53.4 89.9,52.3 101.1,52.3
N$16
  pour Bottom (no thermals): 103.2,67 89.8,67 88.7,65.9 88.7,63.6 89.8,62.5 103.2,62.5
N$17
  pour Bottom (no thermals): 102.2,36.2 90.1,36.2 88.8,34.9 88.8,33.1 90,31.9 102.2,31.9
N$18
  pour Bottom (no thermals): 101.8,46.6 89.9,46.6 88.6,45.3 88.6,43.7 90,42.3 90.1,42.2 101.8,42.2
N$19
  pour Bottom (no thermals): 101.2,16 89.9,16 88.8,14.9 88.8,12.8 89.9,11.7 101.2,11.7
N$20
  pour Bottom (no thermals): 102.2,26.5 90.1,26.5 88.9,25.3 88.9,23.2 90.1,22 102.2,22
N$29
  Top 0.61: 25.4,6.27 27.94,6.27 27.94,2.46 25.4,2.46 25.4,6.27
N$95
  Top 0.61: Q13.B 63.18,16.92 62.3,17.8 62.3,22.7 61.37,23.63 R63.1 60.96,47.42 R4.1
N$96
  Top 0.61: Q13.C 62.23,13.89 AIR.7
  Bottom 0.61: U$37.A@1 U$37.A@2 66.36,12.94 AIR.7
N$101
  Top 0.61: Q14.B 66.99,16.91 65.5,18.4 65.5,22.7 64.57,23.63 R66.1 64.14,47.23 65.53,48.63 R1.1
N$102
  Top 0.61: Q14.C 66.04,12.62 AIR.5
  Bottom 0.61: U$36.A@1 U$36.A@2 62.5,8.29 62.5,13.6 66.7,17.8 68.3,17.8 69.4,16.7 69.4,13 67.75,11.35 AIR.5
N$105
  Top 0.61: Q15.B 70.8,16.9 68.7,19 68.7,22.6 67.67,23.63 R69.1 67.31,47.01 68.07,47.77 R2.1
N$106
  Top 0.61: Q15.C AIR.3
  Bottom 0.61: U$35.A@2 U$35.A@1 75.4,9.03 75.4,15.6 73.3,17.7 71.5,17.7 70.3,16.5 70.3,11.8 AIR.3
N$108
  Top 0.61: Q16.C 73.66,12.62 AIR.1
  Bottom 0.61: U$34.A@2 72.3,13.96 | 72.3,13.96 U$34.A@1 | AIR.1 72.39,13.87 72.3,13.96
N$109
  Top 0.61: Q16.B 74.61,16.89 71.9,19.6 71.9,22.6 70.87,23.63 R72.1 70.48,49.32 R3.1
SPI3_MISO
  Bottom 0.61: U$1.C11 52.18,50.72 48.37,54.53 MPU-9250.5
SPI3_MOSI
  Bottom 0.61: U$1.C12 51.82,48.18 48.01,51.99 MPU-9250.4
SPI3_SCK
  Bottom 0.61: MPU-9250.3 40.65,49.45 38.6,51.5 38.6,54.7 36.4,56.9 32.4,56.9 26.1,50.6 26.1,24.6 27,23.7 34.3,23.7 48.62,38.02 U$1.B3
SPI3_SS
  Bottom 0.61: MPU-9250.6 35.67,54.53 37.1,53.1 37.1,43.8 38.6,42.3 43.9,42.3 44.7,43.1 U$1.B1
SW0
  Bottom 0.61: SW.7 49.2,9.75 49.2,8.3 50.4,7.1 59,7.1 60.4,8.5 60.4,13.3 70.6,23.5 70.6,34.69 U$1.A4
SW1
  Bottom 0.61: SW.5 55.99,14 57.3,14 67.9,24.6 67.9,37.2 71.5,40.8 71.5,47.1 72.4,48 72.4,54.27 U$1.A11
SW2
  Bottom 0.61: SW.3 68.8,24.27 68.8,36.8 72.4,40.4 72.4,46.65 U$1.A8
SW3
  Bottom 0.61: SW.1 58.42,12.62 69.7,23.9 69.7,36.33 U$1.A5
TIM2_CH3
  Bottom 0.61: U$1.B10 78.74,61.15 U$4.IN2
TIM2_CH4
  Bottom 0.61: U$1.B11 78.74,63.69 U$4.IN1
TIM3_CH1
  Bottom 0.61: ENC3.3 26,12.94 26,16.4 27.3,17.7 36.7,17.7 46.3,27.3 48.4,27.3 49.5,26.2 49.5,25.2 50.4,24.3 50.4,23.2 51.3,22.3 51.3,21.3 52.3,20.3 54.5,20.3 56,21.8 56,33.09 U$1.B4
TIM3_CH2
  Bottom 0.61: ENC3.2 17.26,6.7 18.3,6.7 25.1,13.5 25.1,16.9 26.9,18.7 36.3,18.7 45.9,28.3 48.9,28.3 50.4,26.8 50.4,25.8 51.3,24.9 51.3,23.7 52.2,22.8 52.2,21.8 52.8,21.2 54.1,21.2 55.1,22.2 55.1,31.45 U$1.B5
TIM4_CH1
  Bottom 0.61: U$1.B6 51.71,32.3 44.3,32.3 34.7,22.7 26.6,22.7 25.2,24.1 25.2,34.41 U$8.IN2
TIM4_CH2
  Bottom 0.61: U$1.B7 50.17,31.3 44.7,31.3 35.1,21.7 26.2,21.7 24.3,23.6 24.3,32.77 U$8.IN1
TIM4_CH3
  Bottom 0.61: U$1.B8 52.2,26.73 52.2,27.8 49.7,30.3 45.1,30.3 35.5,20.7 24.59,20.7 U$9.IN2
TIM4_CH4
  Bottom 0.61: U$1.B9 52.2,24.19 52.2,25.4 51.3,26.3 51.3,27.3 49.3,29.3 45.5,29.3 35.9,19.7 26.13,19.7 U$9.IN1
TIM5_CH1
  Bottom 0.61: U$1.A0 72.4,26.33 72.4,21.9 77.2,17.1 77.2,12 84.01,5.19 ENC5.3
TIM5_CH2
  Bottom 0.61: U$1.A1 71.5,27.97 71.5,21.4 76.3,16.6 76.3,11.6 81.75,6.15 ENC5.2
TIM8_CH1
  Bottom 0.61: U$1.C6 52.03,65 37.5,65 34.7,67.8 28.2,67.8 27.3,66.9 26,66.9 25.1,67.8 25.1,75.15 U$6.IN2
TIM8_CH2
  Bottom 0.61: U$1.C7 52.99,61.5 39.6,61.5 34.3,66.8 28.6,66.8 27.6,65.8 25.5,65.8 24,67.3 24,73.71 U$6.IN1
TIM8_CH3
  Bottom 0.61: U$1.C8 51.45,60.5 39.3,60.5 33.9,65.9 29.15,65.9 U$7.IN2
TIM8_CH4
  Bottom 0.61: U$1.C9 49.91,59.5 38.9,59.5 33.4,65 29.6,65 27.8,63.2 27.8,62.01 U$7.IN1
TIM9_CH1
  Bottom 0.61: U$1.A2 76.2,30.67 76.2,22.78 U$2.IN2
TIM9_CH2
  Bottom 0.61: U$1.A3 77.2,32.21 77.2,24.32 U$2.IN1
TIM12_CH1
  Bottom 0.61: U$1.B14 78.74,80.93 U$5.IN2
TIM12_CH2
  Bottom 0.61: U$1.B15 78.74,83.47 U$5.IN1
TIM13_CH1
  Bottom 0.61: U$1.A6 76.47,40.56 U$3.IN2
TIM14_CH1
  Bottom 0.61: U$1.A7 76.47,43.1 U$3.IN1
USART3_TX
  Bottom 0.61: U$1.C10 52.24,53.26 48.3,57.2 38.6,57.2 37.46,58.34 U$19.RX
USART5_RX
  Bottom 0.61: U$1.D2 48.26,40.56 34.8,27.1 29.73,27.1 U$17.TX
V+  (via drill 1, 1 pad 1.78)
  Bottom 1.27: U$16.VIN 26.67,86.1 IC2.VIN 30.07,82.7 32.4,82.7 35.7,79.4 37.7,79.4 42.25,74.85 C10.+ 47.55,76.95 J1.4
  other vias: 9.9,18 9.9,20.2 9.9,38.2 9.9,40.2 9.9,58.5 9.9,60.7 9.9,78.9 9.9,81.1 90.5,81.1 90.5,78.6 90.5,61 90.5,58.6 90.5,40.5 90.5,38.1 90.5,20.1 90.5,17.8 25,91.6 35,91.5 60.4,91.4 73.6,91.3
  pour Bottom (no thermals): 0.26,82.3 12,82.3 12,77.5 0.26,77.5
  pour Bottom (no thermals): -0.91,62 12,62 12,57.2 -0.91,57.2
  pour Bottom (no thermals): -2.28,41.4 12,41.4 12,36.9 -2.28,36.9
  pour Bottom (no thermals): -0.9,21.4 12,21.4 12,16.6 -0.9,16.6
  pour Top (no thermals): 45.5,101.6 45.5,88.6 21.8,88.6 20.2,87 20.2,20.8 16,16.6 9.1,16.6 8.4,17.3 8.4,20.5 9.3,21.4 11,21.4 13,23.4 13,34.9 11,36.9 8.5,36.9 8,37.4 8,41 8.4,41.4 11,41.4 13,43.4 13,55.1 10.9,57.2 8.8,57.2 8.1,57.9 8.1,61.2 8.9,62 11,62 13,64 13,75.5 11,77.5 8.6,77.5 8.1,78 8.1,81.7 8.7,82.3 11,82.3 13,84.3 13,92.5 22.1,101.6
  pour Top (no thermals): 45.5,86.4 45.5,79.6 46.9,78.2 50.6,78.2 51.9,79.5 51.9,105.7 47.3,105.7 45.5,105.7
  pour Bottom (no thermals): 89,21.3 101.1,21.3 101.1,16.6 89,16.6
  pour Bottom (no thermals): 89,41.6 100.7,41.6 100.7,36.9 89,36.9
  pour Bottom (no thermals): 89,61.9 101.7,61.9 101.7,57.3 89,57.3
  pour Bottom (no thermals): 89,82.3 102.5,82.3 102.5,77.5 89,77.5
  pour Top (no thermals): 42.7,109.5 74.1,109.5 87.7,95.9 87.7,84 89.4,82.3 91.1,82.3 91.6,81.8 91.6,78 91.1,77.5 89.1,77.5 87.7,76.1 87.7,63.8 89.6,61.9 91.2,61.9 91.7,61.4 91.7,57.8 91.2,57.3 89.7,57.3 87.7,55.3 87.7,43.7 89.8,41.6 91.2,41.6 91.8,41 91.8,37.5 91.2,36.9 89.9,36.9 87.7,34.7 87.7,23.5 89.9,21.3 91.1,21.3 91.7,20.7 91.7,17.3 91,16.6 82.9,16.6 80.1,19.4 80.1,87.2 78.7,88.6 42.7,88.6